# EAGLE design leds (EAGLE 4.11)
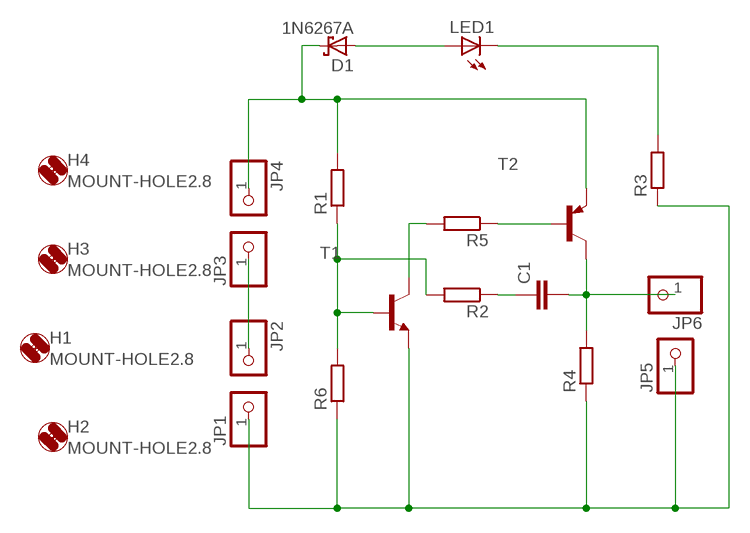
[diagram p0: schematic, sheet 1]

## Parts
C1  C-EU050-025X075  [C050-025X075]
D1  1N6267A  [C4111-15]
H1  MOUNT-HOLE2.8  [2,8]
H2  MOUNT-HOLE2.8  [2,8]
H3  MOUNT-HOLE2.8  [2,8]
H4  MOUNT-HOLE2.8  [2,8]
JP1  PINHD-1X1  [1X01]
JP2  PINHD-1X1  [1X01]
JP3  PINHD-1X1  [1X01]
JP4  PINHD-1X1  [1X01]
JP5  PINHD-1X1  [1X01]
JP6  PINHD-1X1  [1X01]
LED1  LED5MM  [LED5MM]
R1  R-EU_0204/5  [0204/5]
R2  R-EU_0204/5  [0204/5]
R3  R-EU_0204/5  [0204/5]
R4  R-EU_0204/5  [0204/5]
R5  R-EU_0204/5  [0204/5]
R6  R-EU_0204/5  [0204/5]
T1  BC337-16-NPN-TO92-EBC  [TO92-EBC]
T2  BC327-16-PNP-TO92-EBC  [TO92-EBC]

## Nets
N$1: JP2.1 JP3.1
N$2: D1.C JP4.1 R1.2 T2.E
N$3: D1.A LED1.A
N$4: R1.1 R2.2 R6.2 T1.B
N$5: JP1.1 JP5.1 R3.1 R4.1 R6.1 T1.E
N$7: R5.2 T1.C
N$8: R5.1 T2.B
N$9: C1.2 JP6.1 R4.2 T2.C
N$11: C1.1 R2.1
N$14: LED1.K(C) R3.2

## Library data of the parts
C1 = rcl:C-EU: CAPACITOR, European symbol
D1 = diode:1N6267A: DIODE transient voltage suppressor
H1-H4 = holes:MOUNT-HOLE: MOUNTING HOLE with drill center marker
JP1-JP6 = pinhead:PINHD-1X1: PIN HEADER
LED1 = led:LED: LED OSRAM: - CHIPLED LG R971, LG N971, LY N971, LG Q971, LY Q971, LO R971, LY R971 LH N974, LH R974 LS Q976, LO Q976, LY Q976 LO Q996 - Hyper CHIPLED LW Q18S LB Q993, LB Q99A, LB R99A - SideLED LS A670, LO A670, LY A670, LG A670, LP A670 LB A673, LV A673, LT A673, LW A673 LH A674 LY A675 LS A676, LA A676, LO A676, LY A676, LW A676 LS A679, LY A679, LG A679 - Hyper Micro SIDELED® LS Y876, LA Y876, LO Y876, LY Y876 LT Y87S - SmartLED LW L88C, LW L88S LB L89C, LB L89S, LG L890 LS L89K, LO L89K, LY L89K LS L896, LA L896, LO L896, LY L896 - TOPLED LS T670, LO T670, LY T670, LG T670, LP T670 LSG T670, LSP T670, LSY T670, LOP T670, LYG T670 LG T671, LOG T671, LSG T671 LB T673, LV T673, LT T673, LW T673 LH T674 LS T676, LA T676, LO T676, LY T676, LB T676, LH T676, LSB T676, LW T676 LB T67C, LV T67C, LT T67C, LS T67K, LO T67K, LY T67K, LW E67C LS E67B, LA E67B, LO E67B, LY E67B, LB E67C, LV E67C, LT E67C LW T67C LS T679, LY T679, LG T679 LS T770, LO T770, LY T770, LG T770, LP T770 LB T773, LV T773, LT T773, LW T773 LH T774 LS E675, LA E675, LY E675, LS T675 LS T776, LA T776, LO T776, LY T776, LB T776 LHGB T686 LT T68C, LB T68C - Hyper Mini TOPLED® LB M676 - Mini TOPLED Santana® LG M470 LS M47K, LO M47K, LY M47K Source: http://www.osram.convergy.de/
R1-R6 = rcl:R-EU_: RESISTOR, European symbol
T1 = transistor:*-NPN-: NPN Transistror
T2 = transistor:*-PNP-: PNP Transistror

## Board
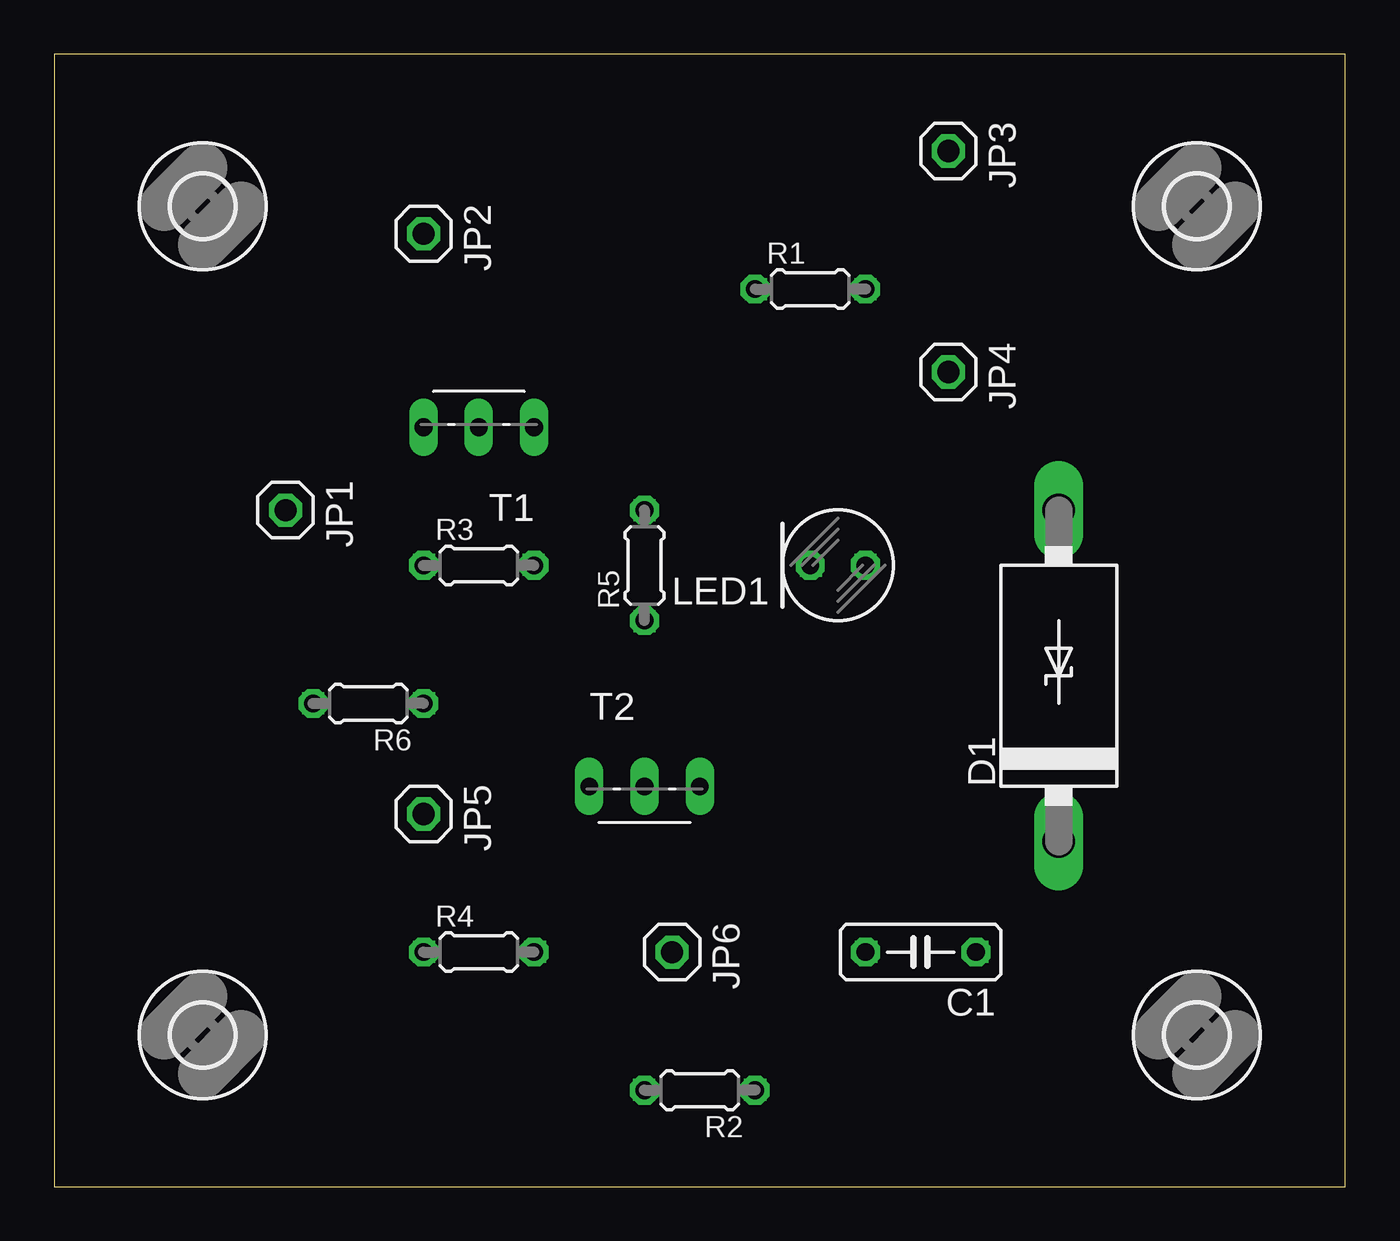
[diagram p1: board, top side]
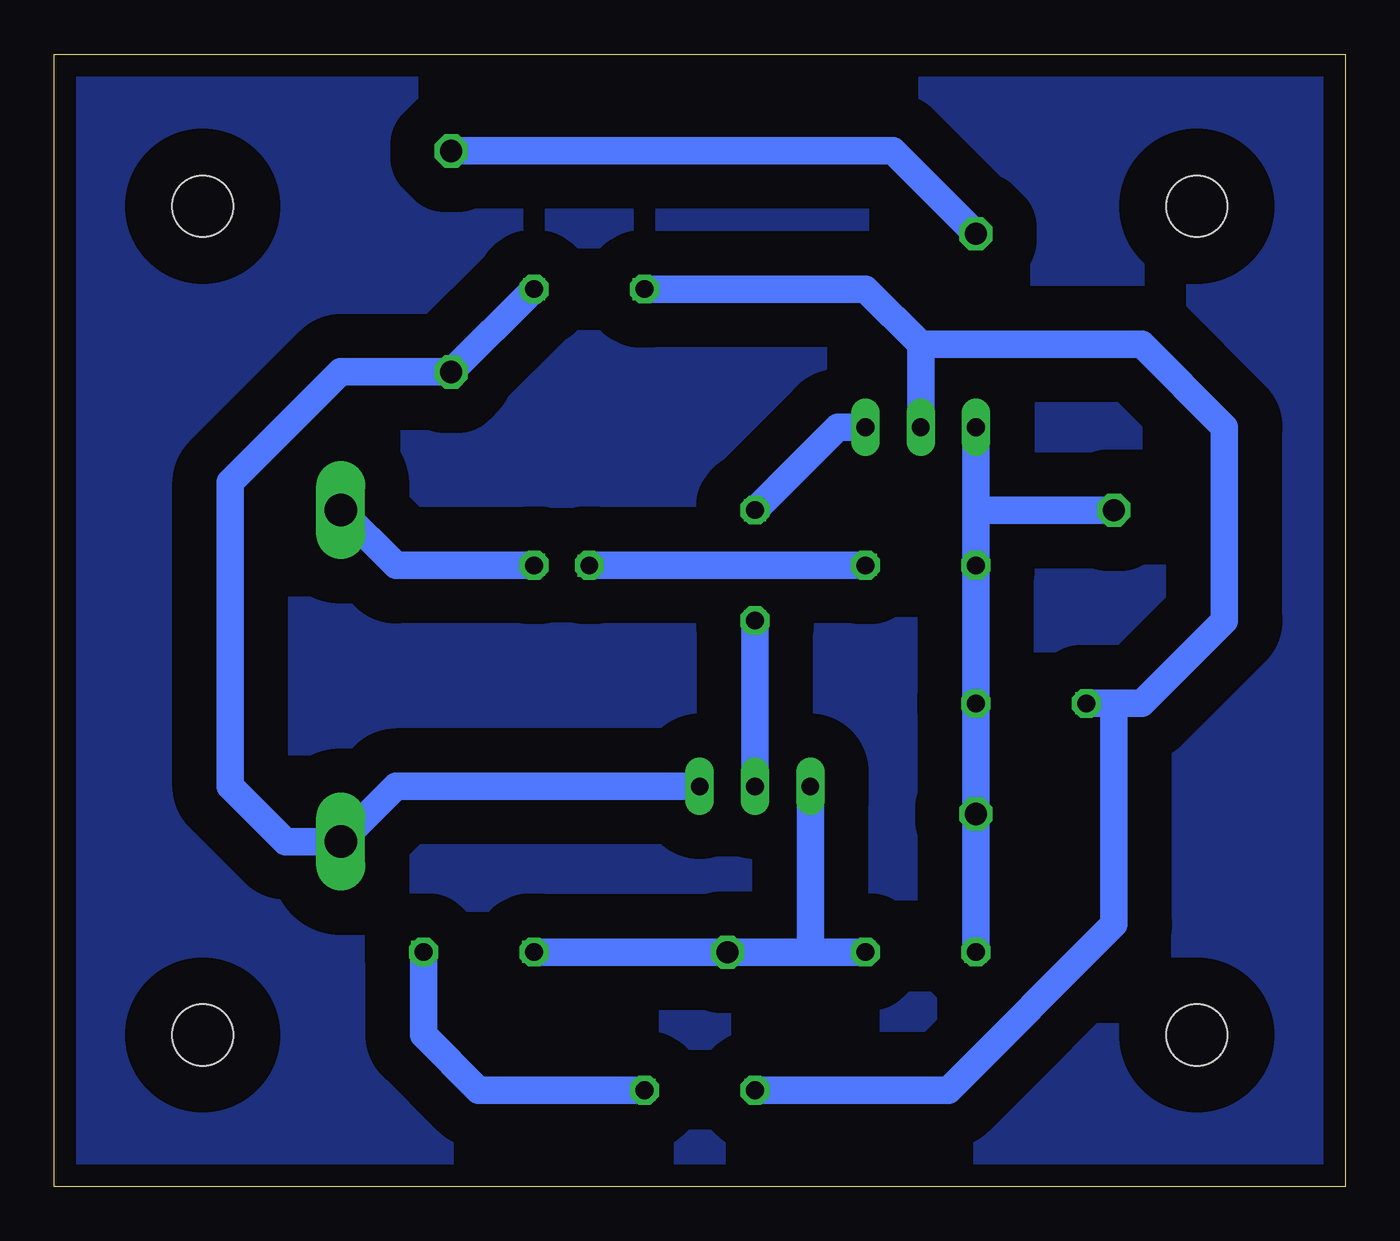
[diagram p2: board, bottom side, seen from below]

Size 59.36 x 52.05 mm. Coordinates in mm from the lower left corner, seen from the top.
Outline: 0,52.05 0,0 59.36,0 59.36,52.05 0,52.05
Copper layers 16: Bottom 0.035mm
Design rules "default": minimum track width 10mil, minimum drill 24mil, track to track 80mil, track to pad 80mil, pad to pad 80mil, via to via 80mil, smd to smd 80mil, copper to edge 40mil, drill to drill 8mil, minimum pad ring 10mil, minimum via ring 8mil, stop-mask expansion 4mil, vias tented up to drill 0mil, thermal gap 10mil

### Footprints (pad centres in the part's own frame; a part is rotated, then mirrored left to right if it is on the bottom)
C050-025X075 = drill 0.813 octagon: 1 -2.54,0; 2 2.54,0
C4111-15 = drill 1.499 long: A 7.62,0; C -7.62,0
2,8 = hole 2.8: 0,0
1X01 = drill 1.016 octagon: 1 0,0
LED5MM = drill 0.813 octagon: A -1.27,0; K 1.27,0
0204/5 = drill 0.813 octagon: 1 -2.54,0; 2 2.54,0
TO92-EBC = drill 0.813 long: B 0,-1.27; C -2.54,-1.27; E 2.54,-1.27

### Placement (x,y rotation side)
C1  39.84,10.78 180 top
D1  46.19,23.48 90 top
H1  52.54,45.07 270 top
H2  6.82,45.07 270 top
H3  6.82,6.97 270 top
H4  52.54,6.97 270 top
JP1  10.63,31.1 270 top
JP2  16.98,43.8 270 top
JP3  41.11,47.61 270 top
JP4  41.11,37.45 270 top
JP5  16.98,17.13 270 top
JP6  28.41,10.78 270 top
LED1  36.03,28.56 180 top
R1  34.76,41.26 0 top
R2  29.68,4.43 180 top
R3  19.52,28.56 0 top
R4  19.52,10.78 0 top
R5  27.14,28.56 90 top
R6  14.44,22.21 180 top
T1  19.52,33.64 180 top
T2  27.14,19.67 0 top

### Tracks (layer width: path | path; a pad name or v marks a point on that pad's centre or on a via)
N$1
  Bottom 1.27: JP2.1 20.79,47.61 JP3.1
N$2
  Bottom 1.27: T2.E 43.65,18.4 D1.C 48.73,15.86 51.27,18.4 51.27,32.37 46.19,37.45 JP4.1 R1.2
N$3
  Bottom 1.27: LED1.A 43.65,28.56 D1.A
N$4
  Bottom 1.27: 19.52,38.72 T1.B | 19.52,38.72 22.06,41.26 R1.1 | 10.63,22.21 9.36,22.21 5.55,26.02 5.55,34.91 9.36,38.72 19.52,38.72 | 10.63,22.21 R6.2 | R2.2 18.25,4.43 10.63,12.05 10.63,22.21
N$5
  Bottom 1.27: 16.98,31.1 R3.1 R6.1 JP5.1 R4.1 | 16.98,31.1 JP1.1 | 16.98,31.1 T1.E
N$6
  pour Bottom: 0.47,0.62 58.89,0.62 58.89,51.42 0.47,51.42
N$7
  Bottom 1.27: T1.C 23.33,34.91 R5.2
N$8
  Bottom 1.27: T2.B R5.1
N$9
  Bottom 1.27: R4.2 24.6,10.78 | 24.6,10.78 JP6.1 C1.2 | 24.6,10.78 T2.C
N$10  (via drill 0.61)
  other vias: 17,34.92
N$11
  Bottom 1.27: R2.1 39.84,4.43 42.38,6.97 C1.1
N$12  (via drill 0.61)
  other vias: 19.55,34.92
N$13  (via drill 0.61)
  other vias: 22.04,34.87
N$14
  Bottom 1.27: R3.2 LED1.K
N$15  (via drill 0.61)
  other vias: 27.14,31.09
N$16  (via drill 0.61)
  other vias: 34.79,28.54
N$17  (via drill 0.61)
  other vias: 37.29,28.59
N$18  (via drill 0.61)
  other vias: 22.04,28.59
N$19  (via drill 0.61)
  other vias: 17,28.59
N$20  (via drill 0.61)
  other vias: 10.62,31.14
N$21  (via drill 0.61)
  other vias: 11.9,22.21
N$22  (via drill 0.61)
  other vias: 17,22.21
N$23  (via drill 0.61)
  other vias: 17,17.16
N$24  (via drill 0.61)
  other vias: 27.14,25.99
N$25  (via drill 0.61)
  other vias: 27.14,18.39
N$26  (via drill 0.61)
  other vias: 29.69,18.39
N$27  (via drill 0.61)
  other vias: 24.59,18.39
N$28  (via drill 0.61)
  other vias: 46.21,31.09
N$29  (via drill 0.61)
  other vias: 46.21,15.88
N$30  (via drill 0.61)
  other vias: 41.12,37.47
N$31  (via drill 0.61)
  other vias: 17,10.8
N$32  (via drill 0.61)
  other vias: 22.11,10.8
N$33  (via drill 0.61)
  other vias: 28.46,10.8
N$34  (via drill 0.61)
  other vias: 37.33,10.8
N$35  (via drill 0.61)
  other vias: 42.44,10.8
N$36  (via drill 0.61)
  other vias: 32.23,4.45
N$37  (via drill 0.61)
  other vias: 27.12,4.45
N$38  (via drill 0.61)
  other vias: 37.29,41.25
N$39  (via drill 0.61)
  other vias: 32.27,41.25
N$40  (via drill 0.61)
  other vias: 41.11,47.6
N$41  (via drill 0.61)
  other vias: 17,43.87